# Altium schematic sheet zucker_E77.SchDoc
size 594 x 420 mm; SheetNumber: 1; SheetTotal: 1; SPICEModelCacheXSTIBOJF: <root> / <DocumentId>XSTIBOJF</DocumentId> / </root>
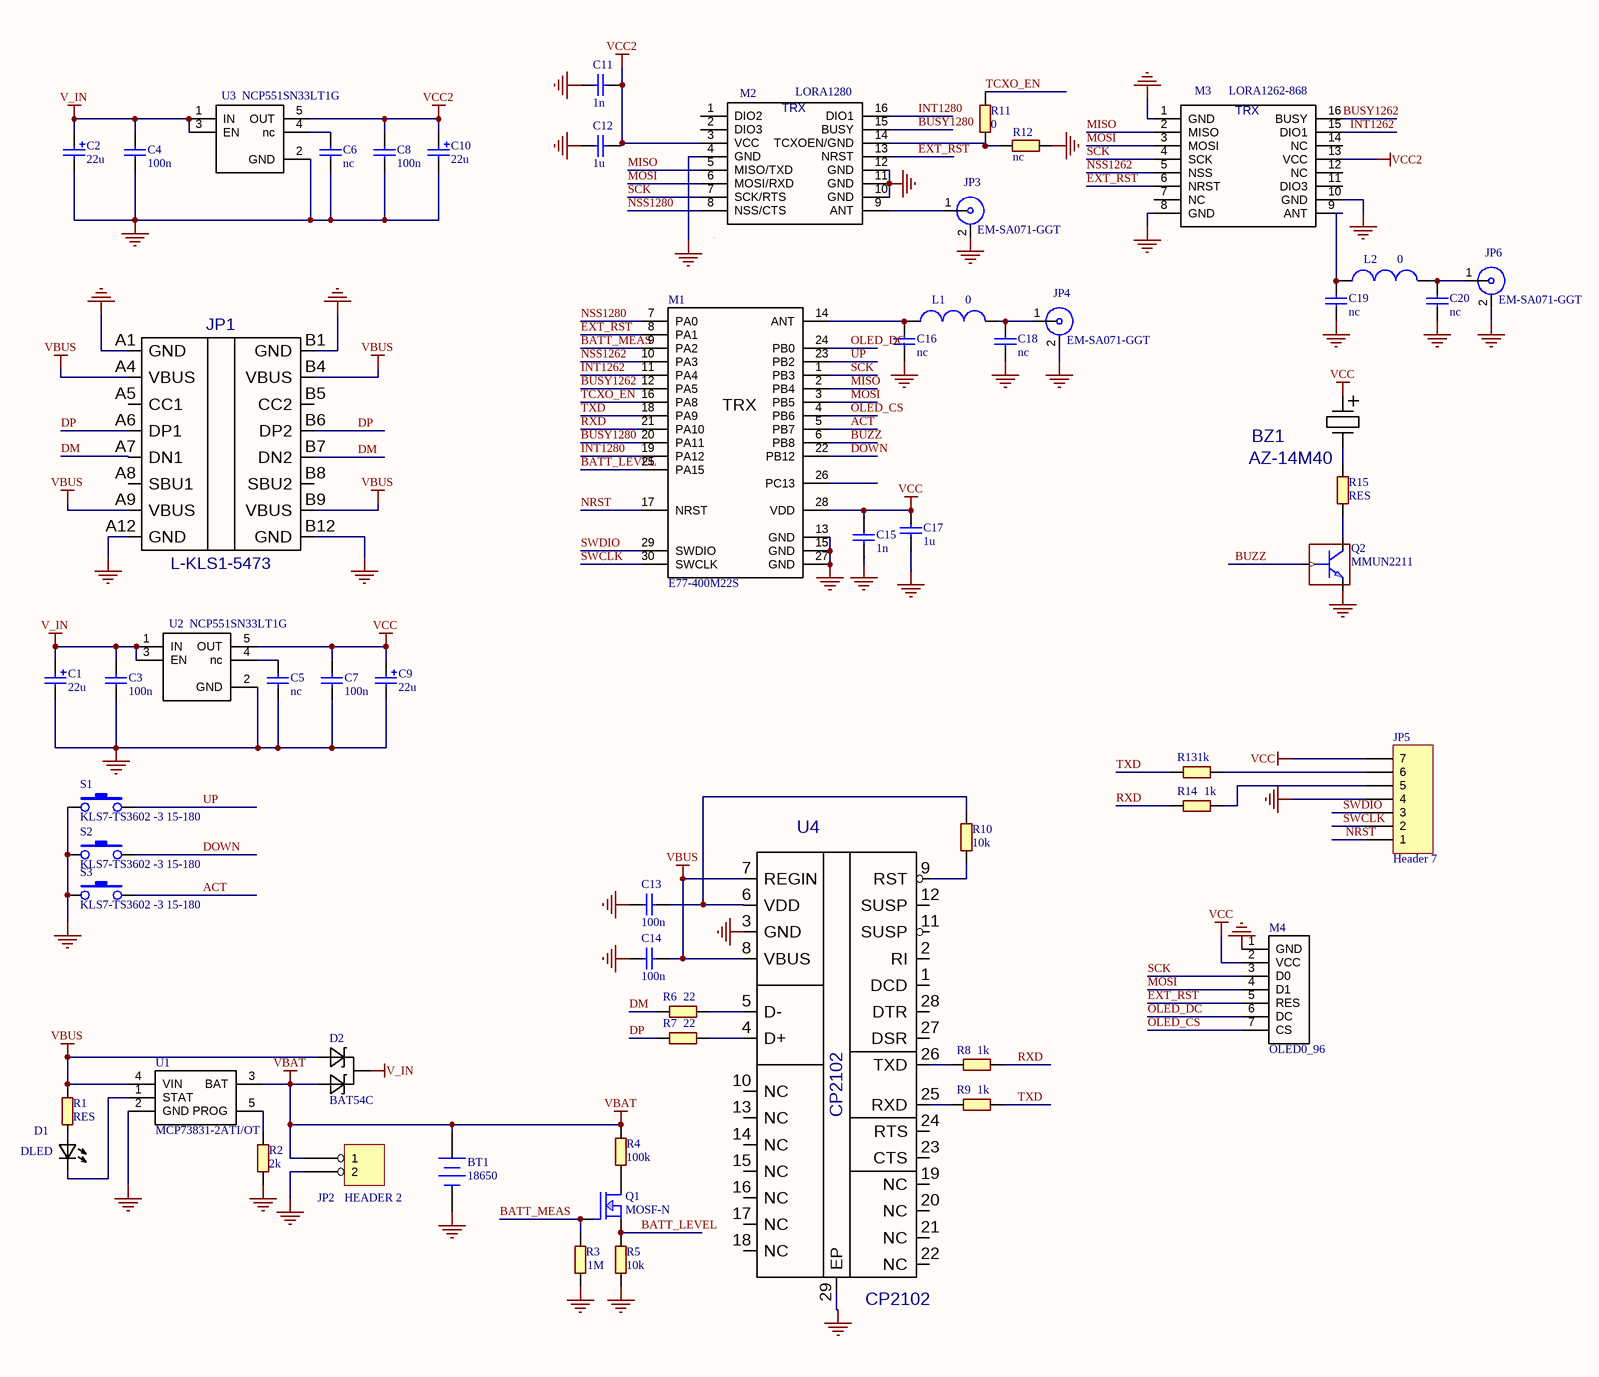
[diagram p0: zucker_E77.SchDoc]

## Parts
BT1  18650  [18650]
BZ1  AZ-14M40  [AZ-14M40]
C1  22u  [C_TANTAL_A]
C2  22u  [C_TANTAL_A]
C3  100n  [C-0603]
C4  100n  [C-0603]
C5  nc  [C-0603]
C6  nc  [C-0603]
C7  100n  [C-0603]
C8  100n  [C-0603]
C9  22u  [C_TANTAL_A]
C10  22u  [C_TANTAL_A]
C11  1n  [C-0603]
C12  1u  [C-0603]
C13  100n  [C-0603]
C14  100n  [C-0603]
C15  1n  [C-0603]
C16  nc  [C-0603]
C17  1u  [C-0603]
C18  nc  [C-0603]
C19  nc  [C-0603]
C20  nc  [C-0603]
D1  DLED  [LED_3mm_RED]
D2  BAT54C  [SOT-23]
JP1  L-KLS1-5473  [L-KLS1-5473]
JP2  HEADER 2  [PLS1-2]
JP3  EM-SA071-GGT  [SMA_F_EDGE]
JP4  EM-SA071-GGT  [SMA_F_EDGE]
JP5  Header 7  [PLS1-7R]
JP6  EM-SA071-GGT  [SMA_F_EDGE]
L1  0  [L-0603]
L2  0  [L-0603]
M1  E77-400M22S  [E77XX-M22]
M2  LORA1280  [LGA16_LORA1280]
M3  LORA1262-868  [LGA16_LORA1280]
M4  OLED0_96  [OLED096]
Q1  MOSF-N  [SOT-23]
Q2  MMUN2211  [SOT-23]
R1  RES  [R-0603]
R2  2k  [R-0603]
R3  1M  [R-0603]
R4  100k  [R-0603]
R5  10k  [R-0603]
R6  22  [R-0603]
R7  22  [R-0603]
R8  1k  [R-0603]
R9  1k  [R-0603]
R10  10k  [R-0603]
R11  0  [R-0603]
R12  nc  [R-0603]
R13  1k  [R-0603]
R14  1k  [R-0603]
R15  RES  [R-0603]
S1  KLS7-TS3602 -3 15-180  [KLS7-TS3602]
S2  KLS7-TS3602 -3 15-180  [KLS7-TS3602]
S3  KLS7-TS3602 -3 15-180  [KLS7-TS3602]
U1  MCP73831-2ATI/OT  [SOT-23-5]
U2  NCP551SN33LT1G  [SOT-23-5]
U3  NCP551SN33LT1G  [SOT-23-5]
U4  CP2102  [QFN28]

## Nets
GND: BT1.2(-) C1.1 C2.1 C3.2 C4.2 C5.2 C6.2 C7.2 C8.2 C9.1 C10.1 C11.2 C12.2 C13.2 C14.1 C15.2 C16.2 C17.2 C18.2 C19.2 C20.2 JP1.A1(GND) JP1.A12(GND) JP1.B1(GND) JP1.B12(GND) JP2.2 JP3.2 JP4.2 JP5.4 JP6.2 M1.13(GND) M1.15(GND) M1.27(GND) M2.4(GND) M2.10(GND) M2.11(GND) M2.12(GND) M3.1(GND) M3.8(GND) M3.10(GND) M4.1(GND) Q2.2(EMITTER) R2.1 R3.2 R5.2 R12.2 S1.1 S2.1 S3.1 U1.2(GND) U2.2(GND) U3.2(GND) U4.3(GND) U4.29(EP)
V_IN: C1.2 C2.2 C3.1 C4.1 D2.3(C1C2) U2.1(IN) U2.3(EN) U3.1(IN) U3.3(EN)
VBAT: BT1.1(+) D2.1(A1) JP2.1 R4.1 U1.3(BAT)
VBUS: C14.2 D2.2(A2) JP1.A4(VBUS) JP1.A9(VBUS) JP1.B4(VBUS) JP1.B9(VBUS) R1.1 U1.4(VIN) U4.7(REGIN) U4.8(VBUS)
VCC: BZ1.1 C7.1 C9.2 C15.1 C17.1 JP5.7 M1.28(VDD) M4.2(VCC) U2.5(OUT)
VCC2: C8.1 C10.2 C11.1 C12.1 M2.3(VCC) M3.13(VCC) U3.5(OUT)
\: M1.5(PB7) S3.2  [also labelled ACT]
BATT_LEVEL: M1.25(PA15) Q1.2(SOURCE) R5.1
BATT_MEAS: M1.9(PA2) Q1.1(GATE) R3.1
BUSY1262: M1.12(PA5) M3.16(BUSY)
BUSY1280: M1.20(PA11) M2.15(BUSY)
BUZZ: M1.6(PB8) Q2.1(BASE)
DM: JP1.A7(DN1) JP1.B7(DN2) R6.2
DOWN: M1.22(PB12) S2.2
DP: JP1.A6(DP1) JP1.B6(DP2) R7.2
EXT_RST: M1.8(PA1) M2.13(NRST) M3.6(NRST) M4.5(RES)
INT1262: M1.11(PA4) M3.15(DIO1)
INT1280: M1.19(PA12) M2.16(DIO1)
MISO: M1.2(PB4) M2.5(MISO/TXD) M3.2(MISO)
MOSI: M1.3(PB5) M2.6(MOSI/RXD) M3.3(MOSI) M4.4(D1)
NRST: JP5.1 M1.17(NRST)
NSS1262: M1.10(PA3) M3.5(NSS)
NSS1280: M1.7(PA0) M2.8(NSS/CTS)
OLED_CS: M1.4(PB6) M4.7(CS)
OLED_DC: M1.24(PB0) M4.6(DC)
RXD: M1.21(PA10) R8.1 R14.2
SCK: M1.1(PB3) M2.7(SCK/RTS) M3.4(SCK) M4.3(D0)
SWCLK: JP5.2 M1.30(SWCLK)
SWDIO: JP5.3 M1.29(SWDIO)
TCXO_EN: M1.16(PA8) R11.2
TXD: M1.18(PA9) R9.1 R13.2
UP: M1.23(PB2) S1.2
NetBZ1_2: BZ1.2 R15.1
NetC5_1: C5.1 U2.4(nc)
NetC6_1: C6.1 U3.4(nc)
NetC13_1: C13.1 R10.1 U4.6(VDD)
NetC16_1: C16.1 L1.1 M1.14(ANT)
NetC18_1: C18.1 JP4.1 L1.2
NetC19_1: C19.1 L2.1 M3.9(ANT)
NetC20_1: C20.1 JP6.1 L2.2
NetD1_1: D1.1 R1.2
NetD1_2: D1.2 U1.1(STAT)
NetJP3_1: JP3.1 M2.9(ANT)
NetJP5_5: JP5.5 R14.1
NetJP5_6: JP5.6 R13.1
NetM2_14: M2.14(TCXOEN/GND) R11.1 R12.1
NetQ1_3: Q1.3(DRAIN) R4.2
NetQ2_3: Q2.3(COLLECTOR) R15.2
NetR2_2: R2.2 U1.5(PROG)
NetR6_1: R6.1 U4.5(D-)
NetR7_1: R7.1 U4.4(D+)
NetR8_2: R8.2 U4.26(TXD)
NetR9_2: R9.2 U4.25(RXD)
NetR10_2: R10.2 U4.9(RST)

Not connected (* = marked no-connect by the designer): JP1 17(VSS) A5(CC1) A8(SBU1) B5(CC2) B8(SBU2); M1 26(PC13); M2 1(DIO2) 2(DIO3); M3 7(NC) 11(DIO3) 12(NC) 14(NC); U4 1(DCD) 2(RI) 10(NC) 11(SUSP) 12(SUSP) 13(NC) 14(NC) 15(NC) 16(NC) 17(NC) 18(NC) 19(NC) 20(NC) 21(NC) 22(NC) 23(CTS) 24(RTS) 27(DSR) 28(DTR)

## Notes on the sheet
- DWG NO:
- REV:
- THIS DOCUMENT AND THE DATA DISCLOSED HEREIN OR
- HEREWITH IS THE PROPERTY OF ALTIUM LIMITED AND MAY
- BE FREELY DISTRIBUTED IN WHOLE. NO RIGHTS ARE
- RESERVED OR EXPRESS OR IMPLIED WARANTEE GIVEN.
- REVISION
- DESCRIPTION
- DATE
- APPROVED
- ENG:
- APPROVALS
- PROJECT
- DSN:
- CHK:
- REFERENCE DOCUMENTS
- PROJECT REVISION:
- TITLE
- DOCUMENT REVISION:
- DESIGN ITEM:
- BOM:
- FAB DWG:
- PCB DWG:
- ASSY DWG:
- SCALE:
- A2
- SIZE
- CAGE CODE
- FILE NAME
- DWG NO.
- SHEET
- OF
- REV
- (in symbol E77-400M22S) TRX
- (in symbol LORA1262) TRX
- (in symbol LORA1280) TRX

## Library data of the parts
BT1 = Battery: Multicell Battery; Published: 24-Mar-1999; LatestRevisionDate: 17-Jul-2002; LatestRevisionNote: Re-released for DXP Platform.; PackageReference: BAT-2; Publisher: Altium Limited; PackageDescription: Battery; 2 Leads; Value: 18650
BZ1 = BUZ-AZ-14M40: Value: {Value}; Mounting  Method: THT
C1 C2 C9 C10 = CAPP: Voltage: 16V; Вид: Конденсатор
C3-C8 C11-C20 = CAPN: Voltage: 50V; Точність/група: NP0; Вид: Конденсатор
D1 = DLED: Вид: Світлодіод
D2 = BAT54C: Вид: Діод
JP1 = L-KLS1-5473: Mounting  Method: SMD; Value: *
JP2 = HEADER 2: Вид: Роз'єм; *: *
JP3 JP4 JP6 = SMA: SMA Female R/A PCB Mount; Вид: Роз'єм
JP5 = Header 7: Header, 7-Pin; LatestRevisionDate: 17-Jul-2002; LatestRevisionNote: Re-released for DXP Platform.; Publisher: Altium Limited
L1 L2 = L: Вид: Індуктивність
M3 = LORA1262
Q1 = MOSF-N: Вид: Транзистор
Q2 = MMUN2211: Вид: Транзистор
R1-R15 = RES: Точність/група: 5%; Вид: Резистор
S1-S3 = SW-1: Вид: Кнопка; Робоча напруга: *
U1 = MCP73831
U2 U3 = LP2980: 50mA Low-Dropout Regulator; Вид: Мікросхема
U4 = CP2102: Value: {Value}; Mounting  Method: SMD